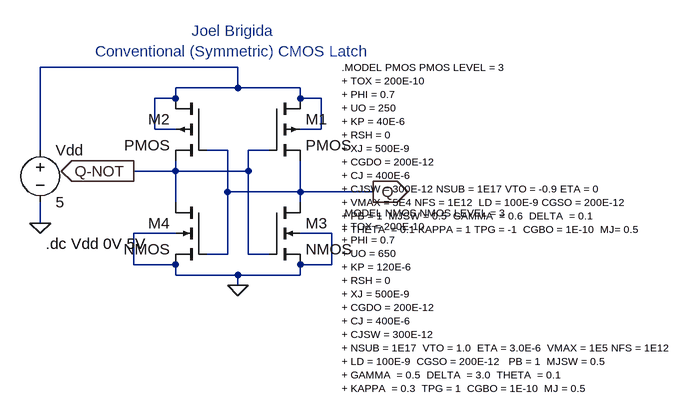
[diagram p0: schematic SymmetricCMOSLatch.asc]
SymmetricCMOSLatch.asc, the LTspice schematic file:
Version 4
SHEET 1 880 680
WIRE 240 32 -64 32
WIRE 240 64 240 32
WIRE 240 64 144 64
WIRE 336 64 240 64
WIRE 144 80 144 64
WIRE 144 80 112 80
WIRE 336 80 336 64
WIRE 368 80 336 80
WIRE 112 128 112 80
WIRE 144 128 112 128
WIRE 368 128 368 80
WIRE 368 128 336 128
WIRE -64 160 -64 32
WIRE 224 160 192 160
WIRE 288 160 256 160
WIRE 144 192 144 176
WIRE 144 192 80 192
WIRE 256 192 256 160
WIRE 256 192 144 192
WIRE 224 224 224 160
WIRE 336 224 336 176
WIRE 336 224 224 224
WIRE 448 224 336 224
WIRE 144 240 144 192
WIRE 336 240 336 224
WIRE -64 272 -64 240
WIRE 144 288 80 288
WIRE 384 288 336 288
WIRE 224 320 224 224
WIRE 224 320 192 320
WIRE 256 320 256 192
WIRE 288 320 256 320
WIRE 80 336 80 288
WIRE 144 336 80 336
WIRE 384 336 384 288
WIRE 384 336 336 336
WIRE 144 352 144 336
WIRE 240 352 144 352
WIRE 336 352 336 336
WIRE 336 352 240 352
WIRE 240 368 240 352
FLAG 240 368 0
FLAG -64 272 0
FLAG 80 192 Q-NOT
IOPIN 80 192 Out
FLAG 448 224 Q
IOPIN 448 224 Out
SYMBOL pmos4 288 80 R0
SYMATTR InstName M1
SYMBOL pmos4 192 80 M0
SYMATTR InstName M2
SYMBOL nmos4 288 240 R0
SYMATTR InstName M3
SYMBOL nmos4 192 240 M0
SYMATTR InstName M4
SYMBOL voltage -64 144 R0
WINDOW 123 0 0 Left 0
WINDOW 39 0 0 Left 0
SYMATTR InstName Vdd
SYMATTR Value 5
TEXT 232 -8 Center 2 ;Joel Brigida\nConventional (Symmetric) CMOS Latch
TEXT 400 256 Left 1 !.MODEL NMOS NMOS LEVEL = 3\n+ TOX = 200E-10\n+ PHI = 0.7\n+ UO = 650\n+ KP = 120E-6\n+ RSH = 0\n+ XJ = 500E-9\n+ CGDO = 200E-12\n+ CJ = 400E-6\n+ CJSW = 300E-12\n+ NSUB = 1E17  VTO = 1.0  ETA = 3.0E-6  VMAX = 1E5 NFS = 1E12   \n+ LD = 100E-9  CGSO = 200E-12   PB = 1  MJSW = 0.5\n+ GAMMA  = 0.5  DELTA  = 3.0  THETA  = 0.1\n+ KAPPA  = 0.3  TPG = 1  CGBO = 1E-10  MJ = 0.5
TEXT 400 32 Left 1 !.MODEL PMOS PMOS LEVEL = 3\n+ TOX = 200E-10\n+ PHI = 0.7\n+ UO = 250 \n+ KP = 40E-6\n+ RSH = 0\n+ XJ = 500E-9 \n+ CGDO = 200E-12 \n+ CJ = 400E-6\n+ CJSW = 300E-12 NSUB = 1E17 VTO = -0.9 ETA = 0\n+ VMAX = 5E4 NFS = 1E12  LD = 100E-9 CGSO = 200E-12\n+ PB = 1  MJSW = 0.5  GAMMA  = 0.6  DELTA  = 0.1\n+ THETA  = 0.1 KAPPA = 1 TPG = -1  CGBO = 1E-10  MJ= 0.5
TEXT -56 304 Left 2 !.dc Vdd 0V 5V

The netlist it stands for:
* SymmetricCMOSLatch.asc
M1 N001 Q-NOT Q N001 PMOS
M2 N001 Q Q-NOT N001 PMOS
M3 Q Q-NOT 0 0 NMOS
M4 Q-NOT Q 0 0 NMOS
Vdd N001 0 5
.model NMOS NMOS
.model PMOS PMOS
.lib standard.mos
* Joel Brigida
* Conventional (Symmetric) CMOS Latch
.MODEL NMOS NMOS LEVEL = 3
+ TOX = 200E-10
+ PHI = 0.7
+ UO = 650
+ KP = 120E-6
+ RSH = 0
+ XJ = 500E-9
+ CGDO = 200E-12
+ CJ = 400E-6
+ CJSW = 300E-12
+ NSUB = 1E17  VTO = 1.0  ETA = 3.0E-6  VMAX = 1E5 NFS = 1E12
+ LD = 100E-9  CGSO = 200E-12   PB = 1  MJSW = 0.5
+ GAMMA  = 0.5  DELTA  = 3.0  THETA  = 0.1
+ KAPPA  = 0.3  TPG = 1  CGBO = 1E-10  MJ = 0.5
.MODEL PMOS PMOS LEVEL = 3
+ TOX = 200E-10
+ PHI = 0.7
+ UO = 250
+ KP = 40E-6
+ RSH = 0
+ XJ = 500E-9
+ CGDO = 200E-12
+ CJ = 400E-6
+ CJSW = 300E-12 NSUB = 1E17 VTO = -0.9 ETA = 0
+ VMAX = 5E4 NFS = 1E12  LD = 100E-9 CGSO = 200E-12
+ PB = 1  MJSW = 0.5  GAMMA  = 0.6  DELTA  = 0.1
+ THETA  = 0.1 KAPPA = 1 TPG = -1  CGBO = 1E-10  MJ= 0.5
.dc Vdd 0V 5V
.backanno
.end